# Altium project SM_thruster_ctrl_and_pressure_sensor.PrjPcb
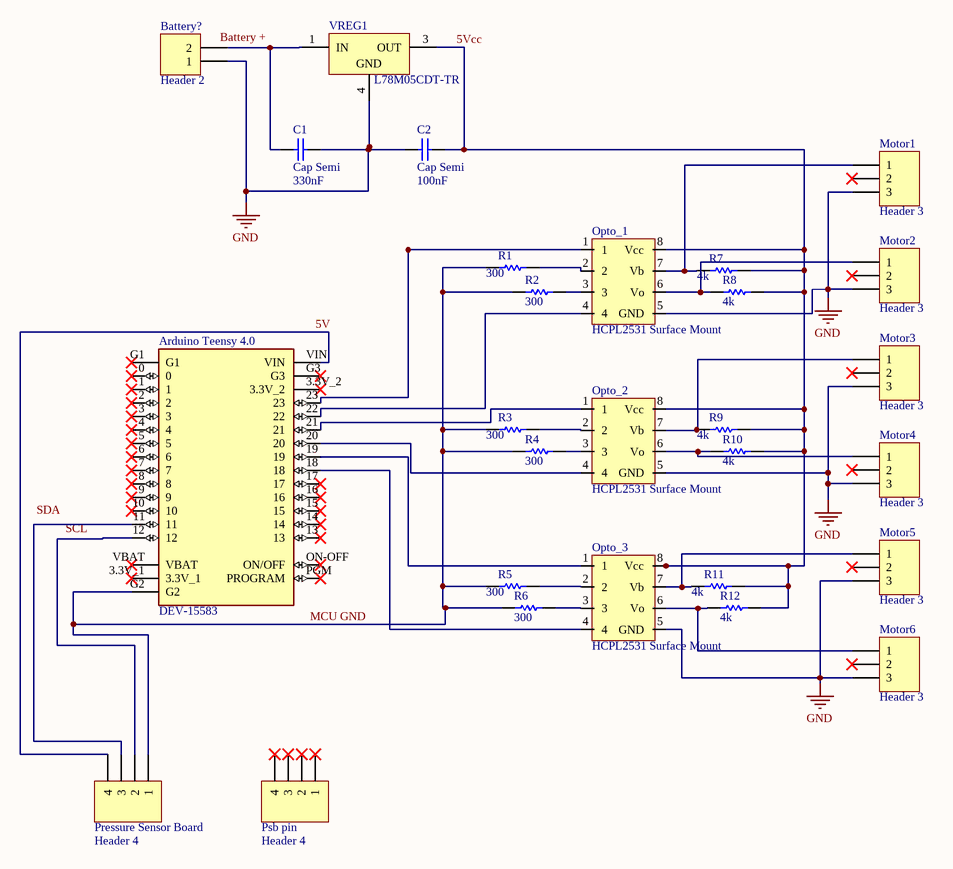
[diagram p0: SM_thruster_ctrl_and_pressure_sensor.SchDoc]
1 sheet, 28 parts. Net scope: global (net labels, ports and power ports of the same name join across sheets).
Board file: SM_thruster_ctrl_and_pressure_sensor.PcbDoc

## Sheet SM_thruster_ctrl_and_pressure_sensor.SchDoc
size A4

### Parts
Arduino_Teensy_4.0  DEV-15583  [MODULE_DEV-15583]
C1  Cap Semi  value 330nF  [C1206]
C2  Cap Semi  value 100nF  [C1206]
Motor1  Header 3  [HDR1X3]
Motor2  Header 3  [HDR1X3]
Motor3  Header 3  [HDR1X3]
Motor4  Header 3  [HDR1X3]
Motor5  Header 3  [HDR1X3]
Motor6  Header 3  [HDR1X3]
Opto_1  HCPL2531 Surface Mount  [HCPL2531]
Opto_2  HCPL2531 Surface Mount  [HCPL2531]
Opto_3  HCPL2531 Surface Mount  [HCPL2531]
Pressure_Sensor_Board  Header 4  [HDR1X4]
Psb_pin  Header 4  [HDR1X4]
PWR  Header 2  [HDR1X2]
R1  300  [RESC3216X70X50NL20T25]
R2  300  [RESC3216X70X50NL20T25]
R3  300  [RESC3216X70X50NL20T25]
R4  300  [RESC3216X70X50NL20T25]
R5  300  [RESC3216X70X50NL20T25]
R6  300  [RESC3216X70X50NL20T25]
R7  4k  [RESC3216X70X50NL20T25]
R8  4k  [RESC3216X70X50NL20T25]
R9  4k  [RESC3216X70X50NL20T25]
R10  4k  [RESC3216X70X50NL20T25]
R11  4k  [RESC3216X70X50NL20T25]
R12  4k  [RESC3216X70X50NL20T25]
VREG1  L78M05CDT-TR  [TO-252_L]

### Nets
GND: C1.2 C2.1 Motor1.3 Motor2.3 Motor3.3 Motor4.3 Motor5.3 Motor6.3 Opto_1.5(GND) Opto_2.5(GND) Opto_3.5(GND) PWR.1 VREG1.4(GND)
5V: Arduino_Teensy_4.0.VIN Pressure_Sensor_Board.4
5Vcc: C2.2 Opto_1.8(Vcc) Opto_2.8(Vcc) Opto_3.8(Vcc) R7.2 R8.2 R9.2 R10.2 R11.2 R12.2 VREG1.3(OUT)
MCU GND: Arduino_Teensy_4.0.G2 Pressure_Sensor_Board.1 R1.1 R2.1 R3.1 R4.1 R5.1 R6.1
NetArduino_Teensy_4.0_11: Arduino_Teensy_4.0.11 Pressure_Sensor_Board.3
NetArduino_Teensy_4.0_12: Arduino_Teensy_4.0.12 Pressure_Sensor_Board.2
NetArduino_Teensy_4.0_18: Arduino_Teensy_4.0.18 Opto_3.4
NetArduino_Teensy_4.0_19: Arduino_Teensy_4.0.19 Opto_3.1
NetArduino_Teensy_4.0_20: Arduino_Teensy_4.0.20 Opto_2.4
NetArduino_Teensy_4.0_21: Arduino_Teensy_4.0.21 Opto_2.1
NetArduino_Teensy_4.0_22: Arduino_Teensy_4.0.22 Opto_1.4
NetArduino_Teensy_4.0_23: Arduino_Teensy_4.0.23 Opto_1.1
NetC1_1: C1.1 PWR.2 VREG1.1(IN)
NetMotor1_1: Motor1.1 Opto_1.7(Vb) R7.1
NetMotor2_1: Motor2.1 Opto_1.6(Vo) R8.1
NetMotor3_1: Motor3.1 Opto_2.7(Vb) R9.1
NetMotor4_1: Motor4.1 Opto_2.6(Vo) R10.1
NetMotor5_1: Motor5.1 Opto_3.7(Vb) R11.1
NetMotor6_1: Motor6.1 Opto_3.6(Vo) R12.1
NetOpto_1_2: Opto_1.2 R1.2
NetOpto_1_3: Opto_1.3 R2.2
NetOpto_2_2: Opto_2.2 R3.2
NetOpto_2_3: Opto_2.3 R4.2
NetOpto_3_2: Opto_3.2 R5.2
NetOpto_3_3: Opto_3.3 R6.2

Not connected (* = marked no-connect by the designer): Arduino_Teensy_4.0 0* 1* 2* 3* 3.3V_1* 3.3V_2* 4* 5* 6* 7* 8* 9* 10* 13* 14* 15* 16* 17* G1* G3* ON-OFF(ON/OFF)* PGM(PROGRAM)* VBAT*; Motor1 2*; Motor2 2*; Motor3 2*; Motor4 2*; Motor5 2*; Motor6 2*; Psb_pin 1* 2* 3* 4*

### Notes on the sheet
- Labels drawn without touching a wire or pin: Battery +, SCL, SDA

### Library data of the parts
Arduino_Teensy_4.0 = DEV-15583: RT1062 Teensy 4.0 i.MX ARMÂ® CortexÂ®-M7 MPU Embedded Evaluation Board; MF: SparkFun Electronics; Value: *; Package: None; Digi-Key_Part_Number: 1568-DEV-15583-ND; Digi-Key_Purchase_URL: https://www.digikey.com/product-detail/en/sparkfun-electronics/DEV-15583/1568-DEV-15583-ND/10384551?utm_source=snapeda&utm_medium=aggregator&utm_campaign=symbol; MP: DEV-15583; SnapEDA_Link: https://www.snapeda.com/parts/DEV-15583/SparkFun%20Electronics/view-part/4001229/?ref=snap; ComponentLink1Description: Download Link; ComponentLink1URL: https://www.snapeda.com/parts/DEV-15583/SparkFun%20Electronics/view-part/?company=Subbots&amp;ref=search&amp;t=teensy+4.0
C1 C2 = Cap Semi: Capacitor (Semiconductor SIM Model); Published: 8-Jun-2000; LatestRevisionDate: 29-May-2009; LatestRevisionNote: IPC-7351 Footprint Added.; PackageReference: C1206; Publisher: Altium Limited; PackageDescription: Chip Capacitor
Motor1-Motor6 = Header 3: Header, 3-Pin; LatestRevisionDate: 17-Jul-2002; LatestRevisionNote: Re-released for DXP Platform.; Publisher: Altium Limited
Opto_1-Opto_3 = HCPL2531: ComponentLink1Description: Datasheet; ComponentLink1URL: https://www.onsemi.com/pub/Collateral/HCPL2531-D.PDF
Pressure_Sensor_Board Psb_pin = Header 4: Header, 4-Pin; LatestRevisionDate: 17-Jul-2002; LatestRevisionNote: Re-released for DXP Platform.; Publisher: Altium Limited
PWR = Header 2: Header, 2-Pin
R1 R3 R5 R7 R9 R11 = CMP-2003-04450-1: Part Number: ERA8AEB301V; Manufacturer: Panasonic
R2 R4 R6 R8 R10 R12 = CMP-2003-04450-1: ERA8AEB301V; Manufacturer: Panasonic; Part Number: ERA8AEB301V
VREG1 = CMP-0244-00178-1: Positive Voltage Regulator, 5V, 3-Pin DPAK, Tape and Reel; PackageReference: TO-252; ComponentLink1URL: http://www.st.com; ComponentLink2Description: Datasheet; PackageDescription: 3-Pin Transistor Outline Package 2.28 mm Pitch, 9.7 mm Lead Span (DPAK); ComponentLink1Description: Manufacturer URL; DatasheetVersion: 1/11/2010; ComponentLink2URL: http://www.st.com/internet/com/TECHNICAL_RESOURCES/TECHNICAL_LITERATURE/DATASHEET/CD00000447.pdf; PackageVersion: 2011